# Altium schematic sheet Main-Sch.SchDoc
size A2; Organization: Altium Limited; Address1: L3, 12a Rodborough Rd; Address2: Frenchs Forest; Address3: NSW; Address4: Australia 2086
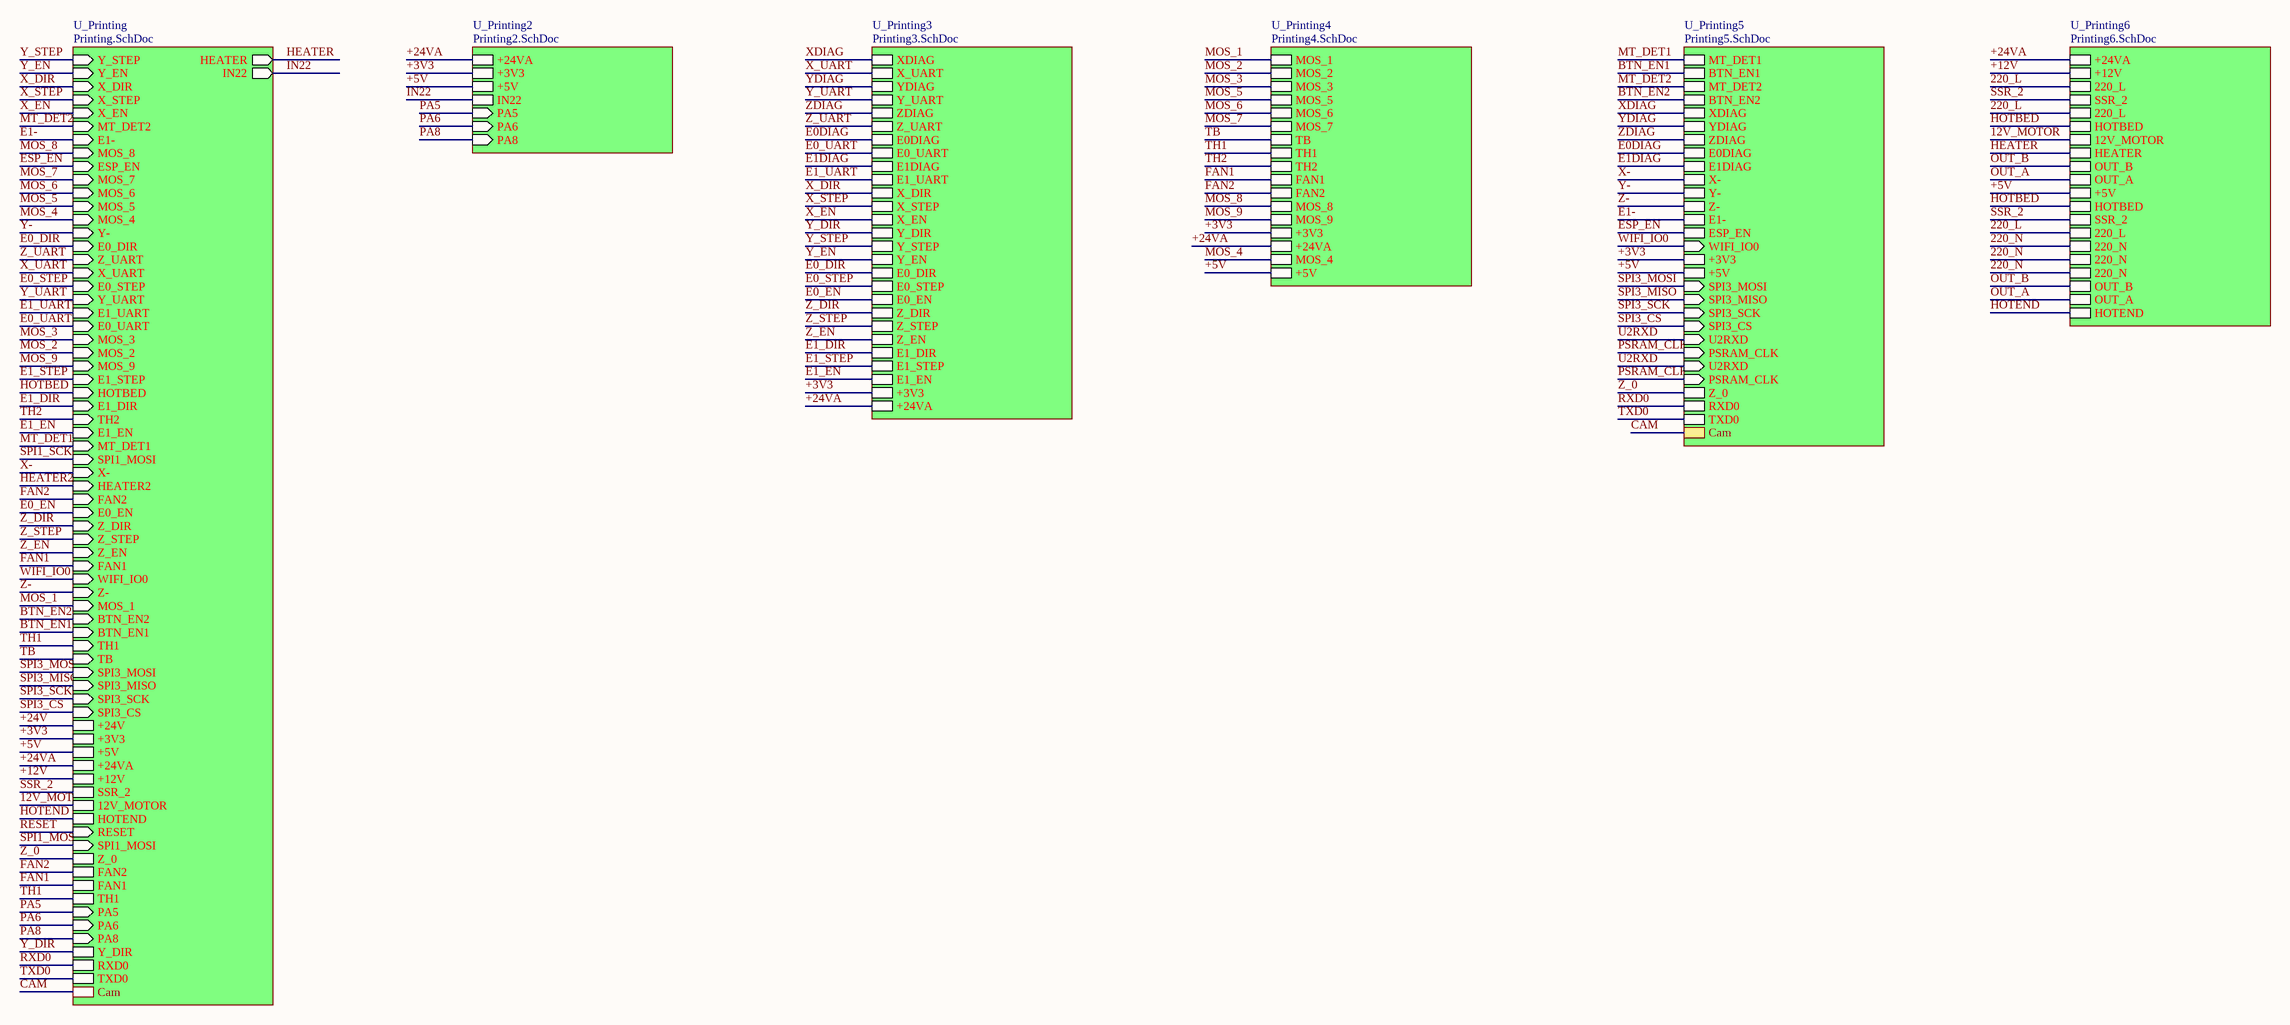
[diagram p0: Main-Sch.SchDoc]

## Sub-sheets
U_Printing = Printing.SchDoc: Y_STEP (in), Y_EN (in), X_DIR (in), X_STEP (in), X_EN (in), HEATER (out), MT_DET2 (in), E1- (in), MOS_8 (in), ESP_EN (in), MOS_7 (in), MOS_6 (in), MOS_5 (in), MOS_4 (in), Y- (in), E0_DIR (in), Z_UART (in), X_UART (in), E0_STEP (in), Y_UART (in), E1_UART (in), E0_UART (in), MOS_3 (in), MOS_2 (in), MOS_9 (in), E1_STEP (in), HOTBED (in), E1_DIR (in), TH2 (in), E1_EN (in), MT_DET1 (in), SPI1_MOSI (in), X- (in), HEATER2 (in), FAN2 (in), E0_EN (in), Z_DIR (in), Z_STEP (in), Z_EN (in), FAN1 (in), WIFI_IO0 (in), Z- (in), MOS_1 (in), BTN_EN2 (in), BTN_EN1 (in), TH1 (in), TB (in), IN22 (out), SPI3_MOSI (in), SPI3_MISO (in), SPI3_SCK (in), SPI3_CS (in), +24V, +3V3, +5V, +24VA, +12V, SSR_2, 12V_MOTOR, HOTEND, RESET (in), SPI1_MOSI (in), Z_0, FAN2, FAN1, TH1, PA5 (in), PA6 (in), PA8 (in), Y_DIR, RXD0, TXD0, Cam
U_Printing2 = Printing2.SchDoc: +24VA, +3V3, +5V, IN22, PA5 (in), PA6 (in), PA8 (in)
U_Printing3 = Printing3.SchDoc: XDIAG, X_UART, YDIAG, Y_UART, ZDIAG, Z_UART, E0DIAG, E0_UART, E1DIAG, E1_UART, X_DIR, X_STEP, X_EN, Y_DIR, Y_STEP, Y_EN, E0_DIR, E0_STEP, E0_EN, Z_DIR, Z_STEP, Z_EN, E1_DIR, E1_STEP, E1_EN, +3V3, +24VA
U_Printing4 = Printing4.SchDoc: MOS_1, MOS_2, MOS_3, MOS_5, MOS_6, MOS_7, TB, TH1, TH2, FAN1, FAN2, MOS_8, MOS_9, +3V3, +24VA, MOS_4, +5V
U_Printing5 = Printing5.SchDoc: MT_DET1, BTN_EN1, MT_DET2, BTN_EN2, XDIAG, YDIAG, ZDIAG, E0DIAG, E1DIAG, X-, Y-, Z-, E1-, ESP_EN, WIFI_IO0 (in), +3V3, +5V, SPI3_MOSI (in), SPI3_MISO (in), SPI3_SCK (in), SPI3_CS (in), U2RXD (in), PSRAM_CLK (in), U2RXD (in), PSRAM_CLK (in), Z_0, RXD0, TXD0, Cam
U_Printing6 = Printing6.SchDoc: +24VA, +12V, 220_L, SSR_2, 220_L, HOTBED, 12V_MOTOR, HEATER, OUT_B, OUT_A, +5V, HOTBED, SSR_2, 220_L, 220_N, 220_N, 220_N, OUT_B, OUT_A, HOTEND

## Nets
12V_MOTOR: sheet U_Printing6/12V_MOTOR, sheet U_Printing/12V_MOTOR
220_L: sheet U_Printing6/220_L, sheet U_Printing6/220_L, sheet U_Printing6/220_L
220_N: sheet U_Printing6/220_N, sheet U_Printing6/220_N, sheet U_Printing6/220_N
+3V3: sheet U_Printing2/+3V3, sheet U_Printing3/+3V3, sheet U_Printing4/+3V3, sheet U_Printing/+3V3, sheet U_Printing5/+3V3
+5V: sheet U_Printing2/+5V, sheet U_Printing4/+5V, sheet U_Printing6/+5V, sheet U_Printing/+5V, sheet U_Printing5/+5V
+12V: sheet U_Printing6/+12V, sheet U_Printing/+12V
+24V: sheet U_Printing/+24V
+24VA: sheet U_Printing2/+24VA, sheet U_Printing3/+24VA, sheet U_Printing4/+24VA, sheet U_Printing6/+24VA, sheet U_Printing/+24VA
BTN_EN1: sheet U_Printing/BTN_EN1, sheet U_Printing5/BTN_EN1
BTN_EN2: sheet U_Printing/BTN_EN2, sheet U_Printing5/BTN_EN2
CAM: sheet U_Printing/Cam, sheet U_Printing5/Cam
E0_DIR: sheet U_Printing3/E0_DIR, sheet U_Printing/E0_DIR
E0_EN: sheet U_Printing3/E0_EN, sheet U_Printing/E0_EN
E0_STEP: sheet U_Printing3/E0_STEP, sheet U_Printing/E0_STEP
E0_UART: sheet U_Printing3/E0_UART, sheet U_Printing/E0_UART
E0DIAG: sheet U_Printing3/E0DIAG, sheet U_Printing5/E0DIAG
E1-: sheet U_Printing/E1-, sheet U_Printing5/E1-
E1_DIR: sheet U_Printing3/E1_DIR, sheet U_Printing/E1_DIR
E1_EN: sheet U_Printing3/E1_EN, sheet U_Printing/E1_EN
E1_STEP: sheet U_Printing3/E1_STEP, sheet U_Printing/E1_STEP
E1_UART: sheet U_Printing3/E1_UART, sheet U_Printing/E1_UART
E1DIAG: sheet U_Printing3/E1DIAG, sheet U_Printing5/E1DIAG
ESP_EN: sheet U_Printing/ESP_EN, sheet U_Printing5/ESP_EN
FAN1: sheet U_Printing4/FAN1, sheet U_Printing/FAN1, sheet U_Printing/FAN1
FAN2: sheet U_Printing4/FAN2, sheet U_Printing/FAN2, sheet U_Printing/FAN2
HEATER: sheet U_Printing6/HEATER, sheet U_Printing/HEATER
HEATER2: sheet U_Printing/HEATER2
HOTBED: sheet U_Printing6/HOTBED, sheet U_Printing6/HOTBED, sheet U_Printing/HOTBED
HOTEND: sheet U_Printing6/HOTEND, sheet U_Printing/HOTEND
IN22: sheet U_Printing2/IN22, sheet U_Printing/IN22
MOS_1: sheet U_Printing4/MOS_1, sheet U_Printing/MOS_1
MOS_2: sheet U_Printing4/MOS_2, sheet U_Printing/MOS_2
MOS_3: sheet U_Printing4/MOS_3, sheet U_Printing/MOS_3
MOS_4: sheet U_Printing4/MOS_4, sheet U_Printing/MOS_4
MOS_5: sheet U_Printing4/MOS_5, sheet U_Printing/MOS_5
MOS_6: sheet U_Printing4/MOS_6, sheet U_Printing/MOS_6
MOS_7: sheet U_Printing4/MOS_7, sheet U_Printing/MOS_7
MOS_8: sheet U_Printing4/MOS_8, sheet U_Printing/MOS_8
MOS_9: sheet U_Printing4/MOS_9, sheet U_Printing/MOS_9
MT_DET1: sheet U_Printing/MT_DET1, sheet U_Printing5/MT_DET1
MT_DET2: sheet U_Printing/MT_DET2, sheet U_Printing5/MT_DET2
OUT_A: sheet U_Printing6/OUT_A, sheet U_Printing6/OUT_A
OUT_B: sheet U_Printing6/OUT_B, sheet U_Printing6/OUT_B
PA5: sheet U_Printing2/PA5, sheet U_Printing/PA5
PA6: sheet U_Printing2/PA6, sheet U_Printing/PA6
PA8: sheet U_Printing2/PA8, sheet U_Printing/PA8
PSRAM_CLK: sheet U_Printing5/PSRAM_CLK, sheet U_Printing5/PSRAM_CLK
RESET: sheet U_Printing/RESET
RXD0: sheet U_Printing/RXD0, sheet U_Printing5/RXD0
SPI1_MOSI: sheet U_Printing/SPI1_MOSI
SPI1_SCK: sheet U_Printing/SPI1_MOSI
SPI3_CS: sheet U_Printing/SPI3_CS, sheet U_Printing5/SPI3_CS
SPI3_MISO: sheet U_Printing/SPI3_MISO, sheet U_Printing5/SPI3_MISO
SPI3_MOSI: sheet U_Printing/SPI3_MOSI, sheet U_Printing5/SPI3_MOSI
SPI3_SCK: sheet U_Printing/SPI3_SCK, sheet U_Printing5/SPI3_SCK
SSR_2: sheet U_Printing6/SSR_2, sheet U_Printing6/SSR_2, sheet U_Printing/SSR_2
TB: sheet U_Printing4/TB, sheet U_Printing/TB
TH1: sheet U_Printing4/TH1, sheet U_Printing/TH1, sheet U_Printing/TH1
TH2: sheet U_Printing4/TH2, sheet U_Printing/TH2
TXD0: sheet U_Printing/TXD0, sheet U_Printing5/TXD0
U2RXD: sheet U_Printing5/U2RXD, sheet U_Printing5/U2RXD
WIFI_IO0: sheet U_Printing/WIFI_IO0, sheet U_Printing5/WIFI_IO0
X-: sheet U_Printing/X-, sheet U_Printing5/X-
X_DIR: sheet U_Printing3/X_DIR, sheet U_Printing/X_DIR
X_EN: sheet U_Printing3/X_EN, sheet U_Printing/X_EN
X_STEP: sheet U_Printing3/X_STEP, sheet U_Printing/X_STEP
X_UART: sheet U_Printing3/X_UART, sheet U_Printing/X_UART
XDIAG: sheet U_Printing3/XDIAG, sheet U_Printing5/XDIAG
Y-: sheet U_Printing/Y-, sheet U_Printing5/Y-
Y_DIR: sheet U_Printing3/Y_DIR, sheet U_Printing/Y_DIR
Y_EN: sheet U_Printing3/Y_EN, sheet U_Printing/Y_EN
Y_STEP: sheet U_Printing3/Y_STEP, sheet U_Printing/Y_STEP
Y_UART: sheet U_Printing3/Y_UART, sheet U_Printing/Y_UART
YDIAG: sheet U_Printing3/YDIAG, sheet U_Printing5/YDIAG
Z-: sheet U_Printing/Z-, sheet U_Printing5/Z-
Z_0: sheet U_Printing/Z_0, sheet U_Printing5/Z_0
Z_DIR: sheet U_Printing3/Z_DIR, sheet U_Printing/Z_DIR
Z_EN: sheet U_Printing3/Z_EN, sheet U_Printing/Z_EN
Z_STEP: sheet U_Printing3/Z_STEP, sheet U_Printing/Z_STEP
Z_UART: sheet U_Printing3/Z_UART, sheet U_Printing/Z_UART
ZDIAG: sheet U_Printing3/ZDIAG, sheet U_Printing5/ZDIAG

## Notes on the sheet
- Title
- Size:
- Date:
- File:
- A2
- Number:
- Time:
- Revision:
- Sheet
- of